# Altium schematic sheet GL852-1.SchDoc
size A4
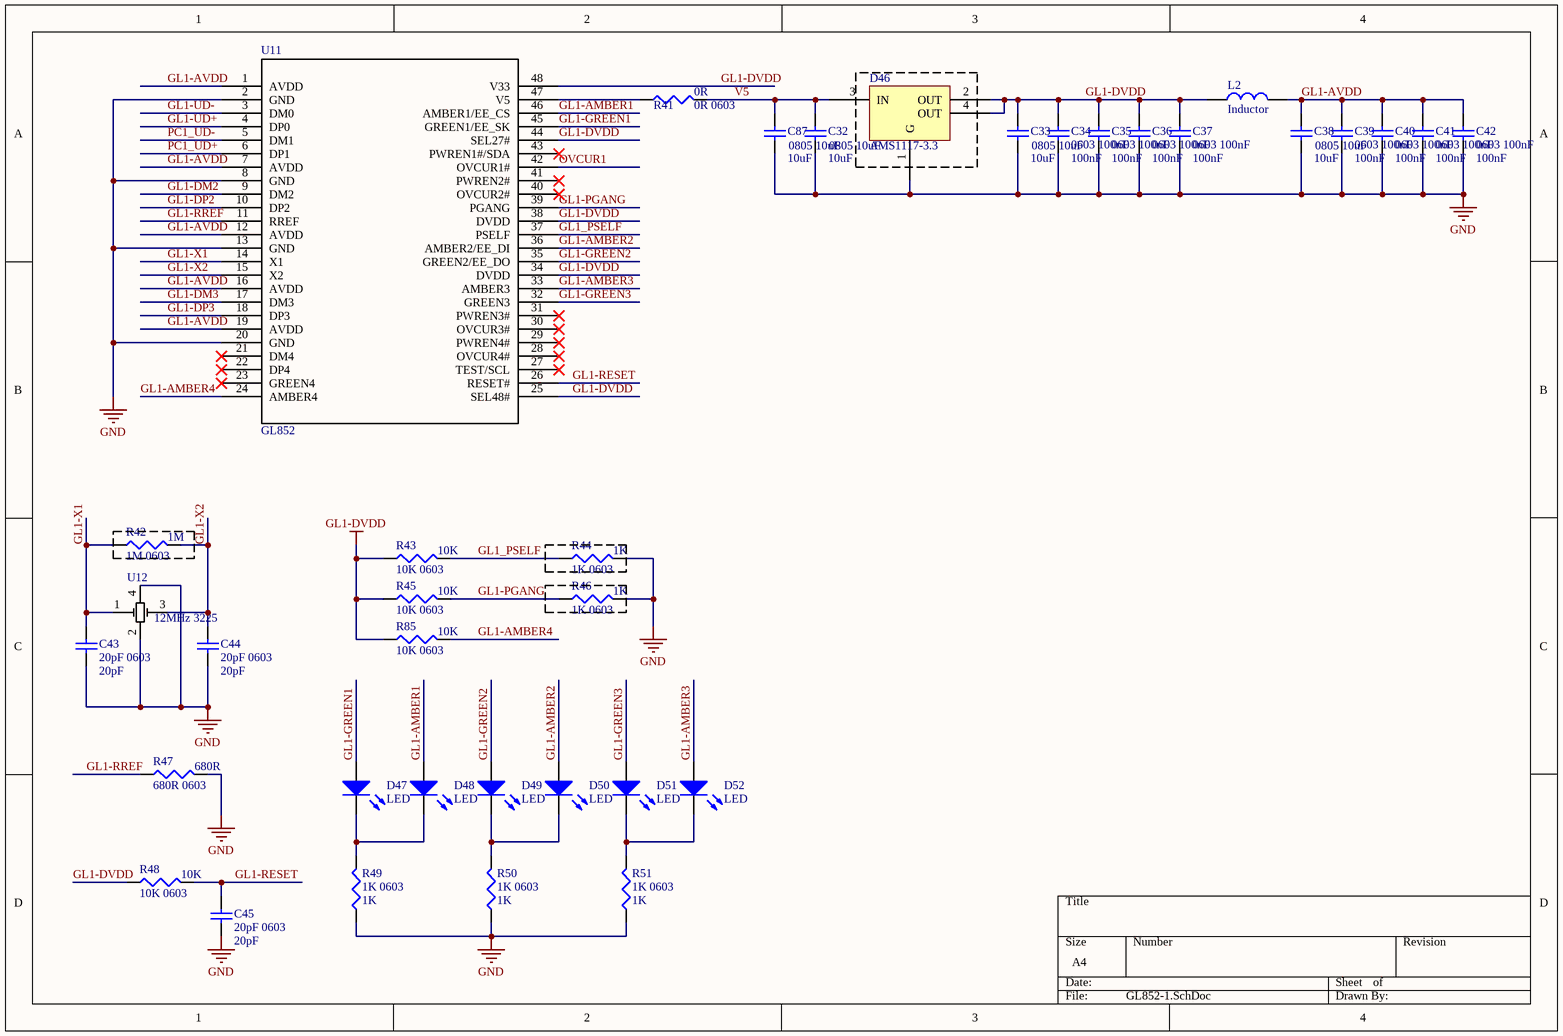
[diagram p0: GL852-1.SchDoc]

## Parts
C32  0805 10uF  value 10uF  [C0805]
C33  0805 10uF  value 10uF  [C0805]
C34  0603 100nF  value 100nF  [C0603]
C35  0603 100nF  value 100nF  [C0603]
C36  0603 100nF  value 100nF  [C0603]
C37  0603 100nF  value 100nF  [C0603]
C38  0805 10uF  value 10uF  [C0805]
C39  0603 100nF  value 100nF  [C0603]
C40  0603 100nF  value 100nF  [C0603]
C41  0603 100nF  value 100nF  [C0603]
C42  0603 100nF  value 100nF  [C0603]
C43  20pF 0603  value 20pF  [C0603]
C44  20pF 0603  value 20pF  [C0603]
C45  20pF 0603  value 20pF  [C0603]
C87  0805 10uF  value 10uF  [C0805]
D46  AMS1117-3.3  [SOT-223]
D47  LED  [LED0603]
D48  LED  [LED0603]
D49  LED  [LED0603]
D50  LED  [LED0603]
D51  LED  [LED0603]
D52  LED  [LED0603]
L2  Inductor  [L0603]
R41  0R 0603  value 0R  [R0603]
R42  1M 0603  value 1M  [R0603]
R43  10K 0603  value 10K  [R0603]
R44  1K 0603  value 1K  [R0603]
R45  10K 0603  value 10K  [R0603]
R46  1K 0603  value 1K  [R0603]
R47  680R 0603  value 680R  [R0603]
R48  10K 0603  value 10K  [R0603]
R49  1K 0603  value 1K  [R0603]
R50  1K 0603  value 1K  [R0603]
R51  1K 0603  value 1K  [R0603]
R85  10K 0603  value 10K  [R0603]
U11  GL852  [qfp48-20-0909b]
U12  12MHz 3225  [XTAL-3225]

## Nets
GL1-DVDD: C33.2 C34.2 C35.2 C36.2 C37.2 D46.2(OUT) D46.4(OUT) L2.1 R43.1 R45.1 R48.1 R85.1 U11.25(SEL48#) U11.34(DVDD) U11.38(DVDD) U11.44(SEL27#) U11.48(V33)
GND: C32.1 C33.1 C34.1 C35.1 C36.1 C37.1 C38.1 C39.1 C40.1 C41.1 C42.1 C43.1 C44.1 C45.1 C87.1 D46.1(G) R44.2 R46.2 R47.2 R49.1 R50.1 R51.1 U11.2(GND) U11.8(GND) U11.13(GND) U11.20(GND) U12.2 U12.4
GL1-AMBER1: D48.1(A) U11.46(AMBER1/EE_CS)
GL1-AMBER2: D50.1(A) U11.36(AMBER2/EE_DI)
GL1-AMBER3: D52.1(A) U11.33(AMBER3)
GL1-AMBER4: R85.2 U11.24(AMBER4)
GL1-AVDD: C38.2 C39.2 C40.2 C41.2 C42.2 L2.2 U11.1(AVDD) U11.7(AVDD) U11.12(AVDD) U11.16(AVDD) U11.19(AVDD)
GL1-DM2: U11.9(DM2)
GL1-DM3: U11.17(DM3)
GL1-DP2: U11.10(DP2)
GL1-DP3: U11.18(DP3)
GL1-GREEN1: D47.1(A) U11.45(GREEN1/EE_SK)
GL1-GREEN2: D49.1(A) U11.35(GREEN2/EE_DO)
GL1-GREEN3: D51.1(A) U11.32(GREEN3)
GL1-PGANG: R45.2 R46.1 U11.39(PGANG)
GL1-RESET: C45.2 R48.2 U11.26(RESET#)
GL1-RREF: R47.1 U11.11(RREF)
GL1-UD+: U11.4(DP0)
GL1-UD-: U11.3(DM0)
GL1-X1: C43.2 R42.1 U11.14(X1) U12.1
GL1-X2: C44.2 R42.2 U11.15(X2) U12.3
GL1_PSELF: R43.2 R44.1 U11.37(PSELF)
OVCUR1: U11.42(OVCUR1#)
PC1_UD+: U11.6(DP1)
PC1_UD-: U11.5(DM1)
V5: C32.2 C87.2 D46.3(IN) R41.2
NetD47_2: D47.2(K) D48.2(K) R49.2
NetD49_2: D49.2(K) D50.2(K) R50.2
NetD51_2: D51.2(K) D52.2(K) R51.2
NetR41_1: R41.1 U11.47(V5)

Not connected (* = marked no-connect by the designer): U11 21(DM4)* 22(DP4)* 23(GREEN4)* 27(TEST/SCL)* 28(OVCUR4#)* 29(PWREN4#)* 30(OVCUR3#)* 31(PWREN3#)* 40(OVCUR2#)* 41(PWREN2#)* 43(PWREN1#/SDA)*

## Library data of the parts
C32-C45 C87 = Cap Semi: Capacitor (Semiconductor SIM Model); Published: 8-Jun-2000; LatestRevisionDate: 29-May-2009; LatestRevisionNote: IPC-7351 Footprint Added.; PackageReference: C1206; Publisher: Altium Limited; PackageDescription: Chip Capacitor
R41-R51 R85 = Res3: Resistor; Published: 8-Jun-2000; LatestRevisionDate: 29-May-2009; LatestRevisionNote: IPC-7351 Footprint Added.; PackageReference: J1-0603; Publisher: Altium Limited; PackageDescription: Chip Resistor
U11 = GL852: Imported; Devide: GL852; RefDes: RefDes; Type: DEV; Value: Value
U12 = Component_1